# Altium schematic sheet hw_system_switch.SchDoc
size A4
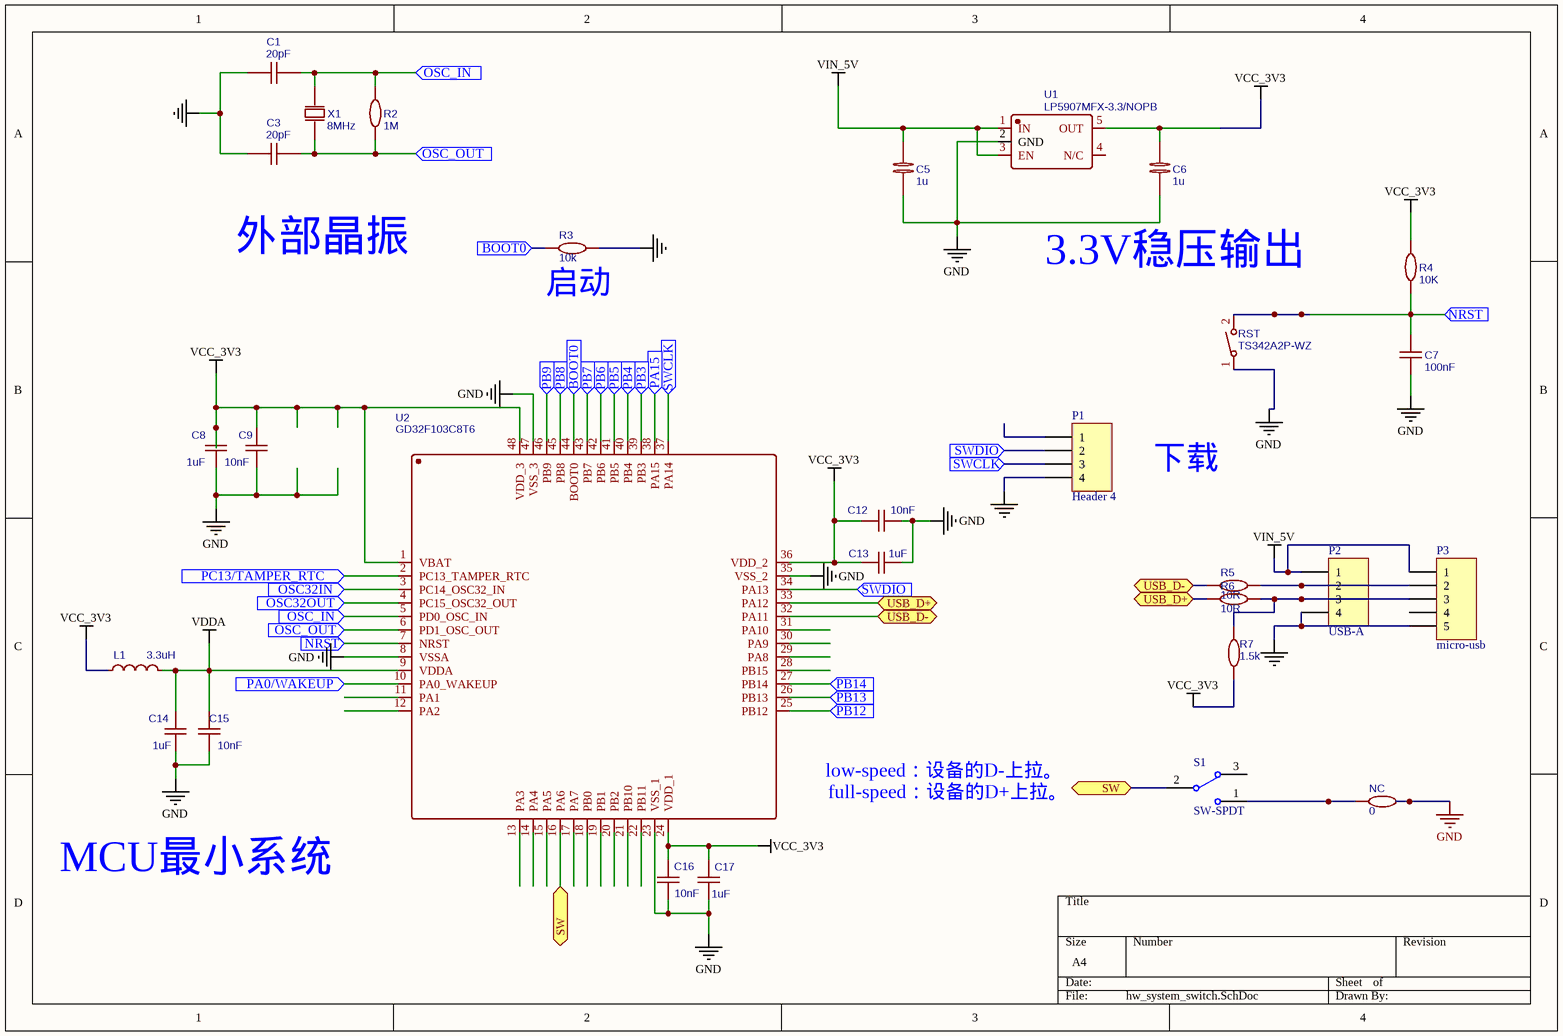
[diagram p0: hw_system_switch.SchDoc]

## Parts
C1  20pF  [0603]
C3  20pF  [0603]
C5  1u  [0603]
C6  1u  [0603]
C7  100nF  [0603]
C8  1uF  [0603]
C9  10nF  [0603]
C12  10nF  [0603]
C13  1uF  [0603]
C14  1uF  [0603]
C15  10nF  [0603]
C16  10nF  [0603]
C17  1uF  [0603]
L1  3.3uH  [C0805]
NC  0  [0603]
P1  Header 4  [HDR1X4]
P2  USB-A  [USB-TH_U-G-04DD-W-4]
P3  micro-usb  [MICRO-USB-SMD_U-F-M5DD-W-2-SUS]
R2  1M  [0603]
R3  10k  [0603]
R4  10K  [0603]
R5  10R  [0603]
R6  10R  [0603]
R7  1.5k  [0603]
RST  TS342A2P-WZ  [SW-SMD_L4.0-W2.9-LS5.0]
S1  SW-SPDT  [PCBComponent_1]
U1  LP5907MFX-3.3/NOPB  [SOT-23-5]
U2  GD32F103C8T6  [TQFP-48_L7.0-W7.0-P0.50-LS9.0-BL]
X1  8MHz  [OSC-SMD_L5.0-W3.2]

## Ports
BOOT0 (in), NRST (in), OSC32IN (in), OSC32OUT (in), OSC_IN (in), OSC_OUT (in), PA0/WAKEUP (in), PA15 (in), PB3 (in), PB4 (in), PB5 (in), PB6 (in), PB7 (in), PB8 (in), PB9 (in), PB12 (in), PB13 (in), PB14 (in), PC13/TAMPER_RTC (in), SW, SWCLK (in), SWDIO (in), USB_D+, USB_D-

## Nets
GND: C1.1 C3.1 C5.2 C6.2 C7.1 C8.1 C9.1 C12.1 C13.1 C14.1 C15.1 C16.1 C17.1 NC.2 P1.4 P2.4 P3.5 R3.1 RST.1 U1.2(GND) U2.8(VSSA) U2.23(VSS_1) U2.35(VSS_2) U2.47(VSS_3)
VCC_3V3: C6.1 C8.2 C9.2 C12.2 C13.2 C16.2 C17.2 L1.2 R4.2 R7.2 U1.5(OUT) U2.1(VBAT) U2.24(VDD_1) U2.36(VDD_2) U2.48(VDD_3)
VDDA: C14.2 C15.2 L1.1 U2.9(VDDA)
VIN_5V: C5.1 P2.1 P3.1 U1.1(IN) U1.3(EN)
BOOT0: R3.2 U2.44(BOOT0) ; port BOOT0
NRST: C7.2 R4.1 RST.2 U2.7(NRST) ; port NRST
OSC32IN: U2.3(PC14_OSC32_IN) ; port OSC32IN
OSC32OUT: U2.4(PC15_OSC32_OUT) ; port OSC32OUT
OSC_IN: C1.2 R2.2 U2.5(PD0_OSC_IN) X1.1(OSC1) ; port OSC_IN
OSC_OUT: C3.2 R2.1 U2.6(PD1_OSC_OUT) X1.2(OSC2) ; port OSC_OUT
PA0/WAKEUP: U2.10(PA0_WAKEUP) ; port PA0/WAKEUP
PA15: U2.38(PA15) ; port PA15
PB3: U2.39(PB3) ; port PB3
PB4: U2.40(PB4) ; port PB4
PB5: U2.41(PB5) ; port PB5
PB6: U2.42(PB6) ; port PB6
PB7: U2.43(PB7) ; port PB7
PB8: U2.45(PB8) ; port PB8
PB9: U2.46(PB9) ; port PB9
PB12: U2.25(PB12) ; port PB12
PB13: U2.26(PB13) ; port PB13
PB14: U2.27(PB14) ; port PB14
PC13/TAMPER_RTC: U2.2(PC13_TAMPER_RTC) ; port PC13/TAMPER_RTC
SW: S1.2 U2.16(PA6) ; port SW
SWCLK: P1.3 U2.37(PA14) ; port SWCLK
SWDIO: P1.2 U2.34(PA13) ; port SWDIO
USB_D+: R6.2 U2.33(PA12) ; port USB_D+
USB_D-: R5.2 U2.32(PA11) ; port USB_D-
NetNC_1: NC.1 S1.1
NetP2_2: P2.2 P3.2 R5.1
NetP2_3: P2.3 P3.3 R6.1 R7.1

Not connected (* = marked no-connect by the designer): P1 1; P3 4; S1 3; U1 4(N/C); U2 11(PA1) 12(PA2) 13(PA3) 14(PA4) 15(PA5) 17(PA7) 18(PB0) 19(PB1) 20(PB2) 21(PB10) 22(PB11) 28(PB15) 29(PA8) 30(PA9) 31(PA10)

## Notes on the sheet
- 外部晶振
- (near R3) 启动
- 3.3V稳压输出
- 下载
- MCU最小系统
- low-speed：设备的D-上拉。
  full-speed：设备的D+上拉。

## Library data of the parts
C1 C3 = 20pF: BOM_Manufacturer: FH; BOM_Manufacturer Part: 0603CG200J500NT; nameAlias: Capacitance; BOM_Supplier: LCSC; BOM_Supplier Part: C91702; spicePre: C; spiceSymbolName: 0603CG200J500NT
C5 C6 = 1u: nameAlias: Value(F); BOM_Manufacturer Part: ?; spicePre: C; spiceSymbolName: Cap_0402_EU
C7 = 100nF: BOM_Manufacturer: FH; BOM_Manufacturer Part: 0603B104K500NT; nameAlias: Capacitance; BOM_Supplier: LCSC; BOM_Supplier Part: C30926; spicePre: C; spiceSymbolName: 0603B104K500NT
C8 C13 C14 C17 = 1uF: BOM_Manufacturer Part: CL10A105KP8NNNC; BOM_Manufacturer: SAMSUNG; nameAlias: Capacitance; BOM_Supplier: LCSC; BOM_Supplier Part: C26413; spicePre: C; spiceSymbolName: CL10A105KP8NNNC
C9 C12 C15 C16 = 10nF: BOM_Manufacturer: YAGEO; BOM_Manufacturer Part: CC0603KRX7R9BB103; nameAlias: Capacitance; BOM_Supplier: LCSC; BOM_Supplier Part: C100042; spicePre: C; spiceSymbolName: CC0603KRX7R9BB103
L1 = 3.3uH: BOM_Manufacturer: FH; BOM_Manufacturer Part: CMI160808U3R3KT; nameAlias: Inductance; BOM_Supplier: LCSC; BOM_Supplier Part: C139209; spicePre: L; spiceSymbolName: CMI160808U3R3KT
NC R2 R3 R5-R7 = 1M: BOM_Manufacturer: YAGEO; BOM_Manufacturer Part: RC0603JR-071ML; nameAlias: Resistance (Ohms); BOM_Supplier: LCSC; BOM_Supplier Part: C107698; spicePre: R; spiceSymbolName: RC0603JR-071ML
P1 P2 = Header 4: Header, 4-Pin; LatestRevisionDate: 17-Jul-2002; LatestRevisionNote: Re-released for DXP Platform.; Publisher: Altium Limited
P3 = Header 5H: Header, 5-Pin, Right Angle; LatestRevisionDate: 17-Jul-2002; LatestRevisionNote: Re-released for DXP Platform.; Publisher: Altium Limited
R4 = 10K: BOM_Manufacturer: YAGEO; BOM_Manufacturer Part: RC0603JR-0710KL; nameAlias: Resistance (Ohms); BOM_Supplier: LCSC; BOM_Supplier Part: C99198; spicePre: R; spiceSymbolName: RC0603JR-0710KL
RST = TS342A2P-WZ: BOM_Manufacturer: SHOU HAN; Contributor: LCSC; BOM_Paste Type: expand; BOM_Assembly Type: smtWeld; BOM_Supplier: LCSC; BOM_Supplier Part: C557591; BOM_Manufacturer Part: TS342A2P-WZ; spicePre: S; spiceSymbolName: TS342A2P-WZ
S1 = SW-SPDT: SPDT Subminiature Toggle Switch, Right Angle Mounting, Vertical Actuation; Published: 24-Mar-1999; LatestRevisionDate: 17-Dec-2003; LatestRevisionNote: Schematic revised, PCB Footprint replaced.; DatasheetVersion: 05-Dec-2000; PackageReference: TL36WW15050; Publisher: Altium Limited; PackageDescription: Switch; 4 Leads; ComponentLink1Description: Manufacturer Link; ComponentLink1URL: http://www.apem.com
U1 = LP5907MFX-3.3/NOPB: BOM_Manufacturer: Texas Instruments; Contributor: LCSC; SMT Type: Extend; BOM_Supplier: LCSC; BOM_Supplier Part: C80670; BOM_Manufacturer Part: LP5907MFX-3.3/NOPB; BOM_LCSC Assembly: Yes; spicePre: U
U2 = GD32F103C8T6: BOM_Manufacturer: GigaDevice; SMT Type: Extend; BOM_Supplier: LCSC; BOM_Manufacturer Part: GD32F103C8T6; image: //image.lceda.cn/szlcsc/C77994.jpg; BOM_Supplier Part: C77994; BOM_LCSC Assembly: Yes; spicePre: U; spiceSymbolName: GD32F103C8T6
X1 = 8MHz: BOM_Manufacturer: YXC; BOM_Manufacturer Part: X49SD8MSD2SC; nameAlias: Frequency; BOM_Supplier: LCSC; BOM_Supplier Part: C21263; spicePre: X; spiceSymbolName: X49SD8MSD2SC